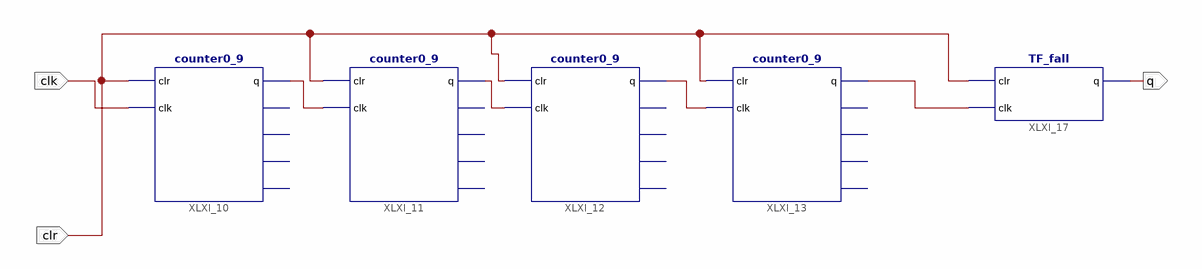
[diagram p0: schematic sheet 1]
// Xilinx ISE schematic counter0_20k.sch (spartan6) as structural Verilog: 5 symbols, 3 ports
module counter0_20k (
  input  clk,
  input  clr,
  output q
);

  wire XLXN_47, XLXN_48, XLXN_49, XLXN_50;

  counter0_9 XLXI_10 (.clk(clk), .clr(clr), .q(XLXN_47));  // open: bit0, bit1, bit2, bit3
  counter0_9 XLXI_11 (.clk(XLXN_47), .clr(clr), .q(XLXN_48));  // open: bit0, bit1, bit2, bit3
  counter0_9 XLXI_12 (.clk(XLXN_48), .clr(clr), .q(XLXN_49));  // open: bit0, bit1, bit2, bit3
  counter0_9 XLXI_13 (.clk(XLXN_49), .clr(clr), .q(XLXN_50));  // open: bit0, bit1, bit2, bit3
  TF_fall XLXI_17 (.clr(clr), .clk(XLXN_50), .q(q));
endmodule
